# EAGLE design perfboard-tiny45usb1 (EAGLE 5.06)
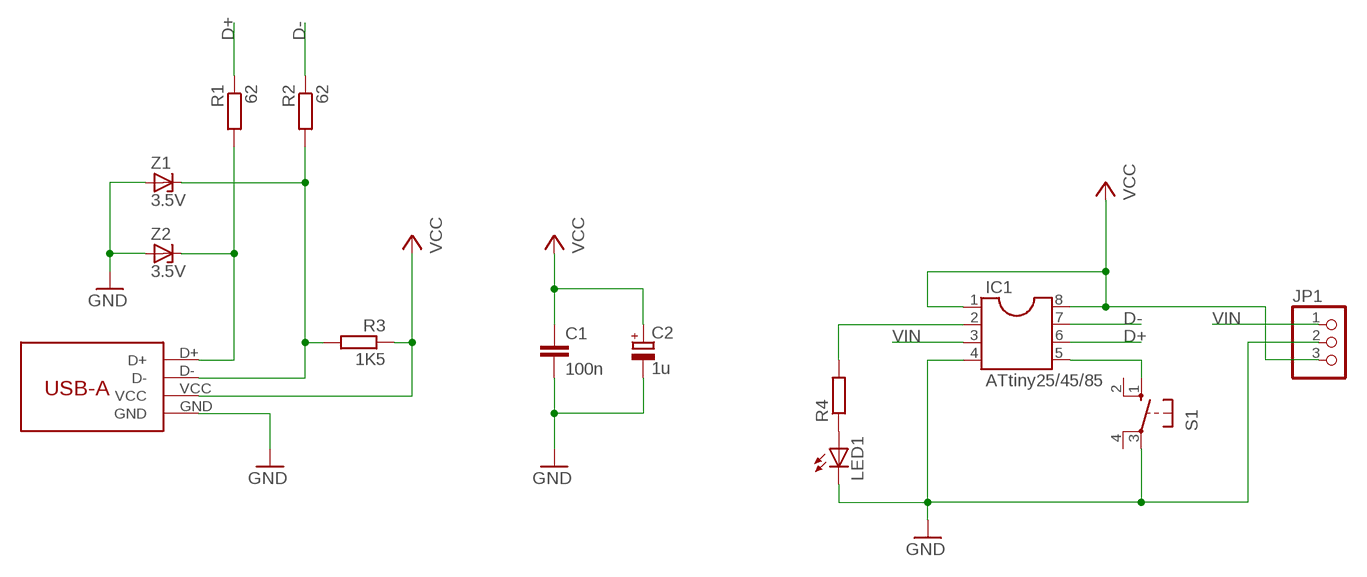
[diagram p0: schematic, sheet 1]

## Parts
C1  100n  CYYC10B4  [YC10B4]
C2  1u  CPOL-EUE2,5-6E  [E2,5-6E]
IC1  ATtiny25/45/85  DIL8  [DIL08]
JP1  PINHD-1X3  [1X03]
LED1  LED3MM  [LED3MM]
R1  62  R-EU_0204/2V  [0204V]
R2  62  R-EU_0204/2V  [0204V]
R3  1K5  R-EU_0207/2V  [0207/2V]
R4  R-EU_0204/7  [0204/7]
S1  10-XX  [B3F-10XX]
U$2  USB-A  [DIP]
Z1  3.5V  ZENER-DIODEZD-7.5  [ZDIO-7.5]
Z2  3.5V  ZENER-DIODEZD-5  [ZDIO-5]

## Nets
D+: IC1.6 R1.1
D-: IC1.7 R2.1
GND: C1.2 C2.- IC1.4 JP1.2 LED1.K(C) S1.3(P) U$2.GND Z1.A Z2.A
N$1: R1.2 U$2.D+ Z2.C
N$2: R2.2 R3.2 U$2.D- Z1.C
N$3: IC1.5 S1.1(S)
N$6: LED1.A R4.1
N$7: IC1.2 R4.2
VCC: C1.1 C2.+ IC1.1 IC1.8 JP1.3 R3.1 U$2.VCC
VIN: IC1.3 JP1.1
Unconnected: S1.2(S1) S1.4(P1)

## Library data of the parts
C1 = rcl:CY: Y CAPACITOR for power line
C2 = rcl:CPOL-EU: POLARIZED CAPACITOR, European symbol
IC1 = ic-package:DIL8: Dual In Line / Socket
JP1 = pinhead:PINHD-1X3: PIN HEADER
LED1 = led:LED: LED OSRAM: - CHIPLED LG R971, LG N971, LY N971, LG Q971, LY Q971, LO R971, LY R971 LH N974, LH R974 LS Q976, LO Q976, LY Q976 LO Q996 - Hyper CHIPLED LW Q18S LB Q993, LB Q99A, LB R99A - SideLED LS A670, LO A670, LY A670, LG A670, LP A670 LB A673, LV A673, LT A673, LW A673 LH A674 LY A675 LS A676, LA A676, LO A676, LY A676, LW A676 LS A679, LY A679, LG A679 - Hyper Micro SIDELED® LS Y876, LA Y876, LO Y876, LY Y876 LT Y87S - SmartLED LW L88C, LW L88S LB L89C, LB L89S, LG L890 LS L89K, LO L89K, LY L89K LS L896, LA L896, LO L896, LY L896 - TOPLED LS T670, LO T670, LY T670, LG T670, LP T670 LSG T670, LSP T670, LSY T670, LOP T670, LYG T670 LG T671, LOG T671, LSG T671 LB T673, LV T673, LT T673, LW T673 LH T674 LS T676, LA T676, LO T676, LY T676, LB T676, LH T676, LSB T676, LW T676 LB T67C, LV T67C, LT T67C, LS T67K, LO T67K, LY T67K, LW E67C LS E67B, LA E67B, LO E67B, LY E67B, LB E67C, LV E67C, LT E67C LW T67C LS T679, LY T679, LG T679 LS T770, LO T770, LY T770, LG T770, LP T770 LB T773, LV T773, LT T773, LW T773 LH T774 LS E675, LA E675, LY E675, LS T675 LS T776, LA T776, LO T776, LY T776, LB T776 LHGB T686 LT T68C, LB T68C - Hyper Mini TOPLED® LB M676 - Mini TOPLED Santana® LG M470 LS M47K, LO M47K, LY M47K Source: http://www.osram.convergy.de LUXEON: - LUMILED® LXK2-PW12-R00, LXK2-PW12-S00, LXK2-PW14-U00, LXK2-PW14-V00 LXK2-PM12-R00, LXK2-PM12-S00, LXK2-PM14-U00 LXK2-PE12-Q00, LXK2-PE12-R00, LXK2-PE12-S00, LXK2-PE14-T00, LXK2-PE14-U00 LXK2-PB12-K00, LXK2-PB12-L00, LXK2-PB12-M00, LXK2-PB14-N00, LXK2-PB14-P00, LXK2-PB14-Q00 LXK2-PR12-L00, LXK2-PR12-M00, LXK2-PR14-Q00, LXK2-PR14-R00 LXK2-PD12-Q00, LXK2-PD12-R00, LXK2-PD12-S00 LXK2-PH12-R00, LXK2-PH12-S00 LXK2-PL12-P00, LXK2-PL12-Q00, LXK2-PL12-R00 Source: www.luxeon.com KINGBRIGHT: KA-3528ASYC Source: www.kingbright.com
R1-R4 = rcl:R-EU_: RESISTOR, European symbol
S1 = switch-omron:10-XX: OMRON SWITCH
U$2 = assmann-usb-a-dip:USB-A
Z1 Z2 = diode:ZENER-DIODE: Z-Diode

## Board
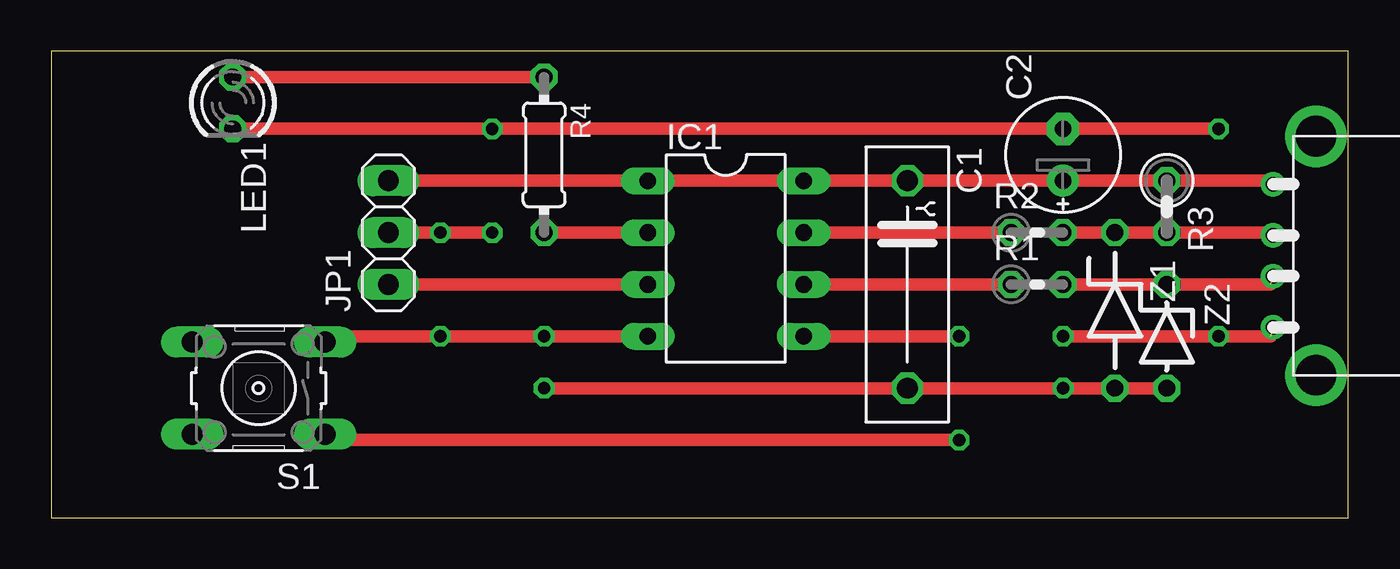
[diagram p1: board, top side]
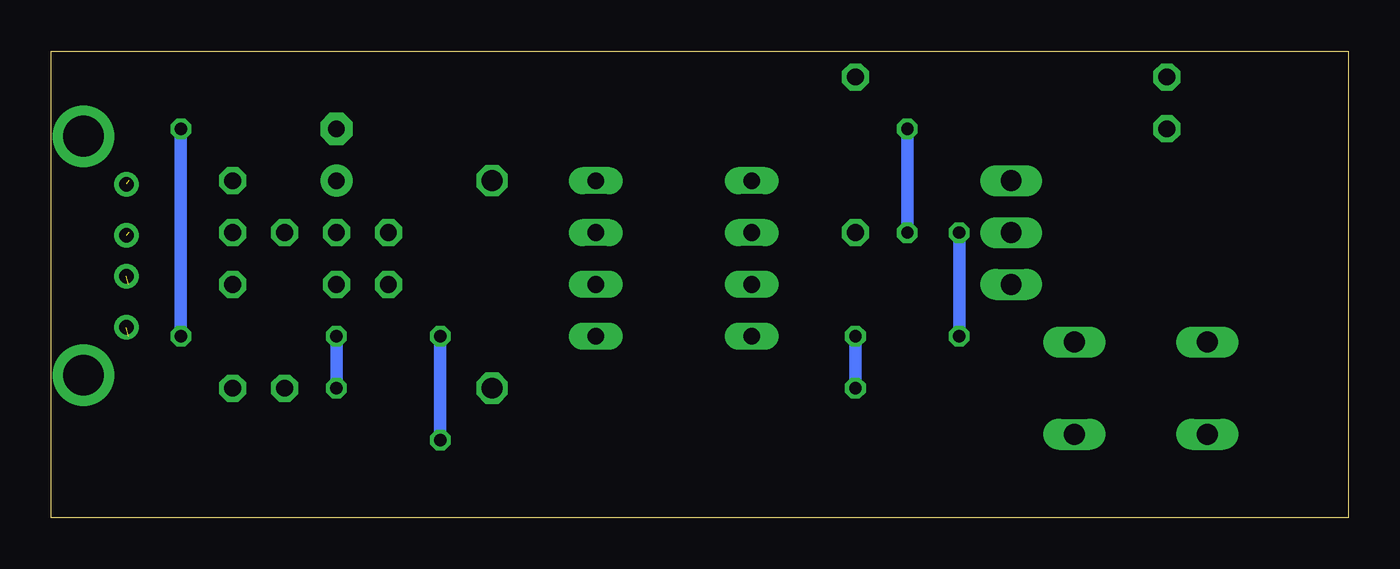
[diagram p2: board, bottom side, seen from below]

Size 63.5 x 22.86 mm. Coordinates in mm from the lower left corner, seen from the top.
Outline: 0,0 63.5,0 63.5,22.86 0,22.86 0,0
Copper layers (1*16): Top 0.035mm / dielectric 1.5mm / Bottom 0.035mm
Design rules "default": minimum track width 10mil, minimum drill 24mil, track to track 8mil, track to pad 8mil, pad to pad 8mil, via to via 8mil, smd to smd 8mil, copper to edge 40mil, drill to drill 8mil, minimum pad ring 10mil, minimum via ring 8mil, stop-mask expansion 4mil, vias tented up to drill 0mil, thermal gap 10mil

### Footprints (pad centres in the part's own frame; a part is rotated, then mirrored left to right if it is on the bottom)
YC10B4 = drill 1.016 octagon: 1 -5.08,0; 2 5.08,0
E2,5-6E = drill 0.813 pad 1.575 round: + -1.27,0 | drill 0.813 pad 1.575 octagon: - 1.27,0
DIL08 = drill 0.813 long: 1 -3.81,-3.81; 2 -1.27,-3.81; 3 1.27,-3.81; 4 3.81,-3.81; 5 3.81,3.81; 6 1.27,3.81; 7 -1.27,3.81; 8 -3.81,3.81
1X03 = drill 1.016 long: 1 -2.54,0; 2 0,0; 3 2.54,0
LED3MM = drill 0.813 octagon: A -1.27,0; K 1.27,0
0204V = drill 0.813 octagon: 1 -1.27,0; 2 1.27,0
0207/2V = drill 0.813 octagon: 1 -1.27,0; 2 1.27,0
0204/7 = drill 0.813 octagon: 1 -3.81,0; 2 3.81,0
B3F-10XX = drill 1.016 long: 1 -3.251,2.261; 2 3.251,2.261; 3 -3.251,-2.261; 4 3.251,-2.261
DIP = drill 0.7 round: D+ 4.85,2.1; D- 6.85,2.1; GND 2.35,2.1; VCC 9.35,2.1 | drill 2 round: P$1 0,0; P$2 11.7,0
ZDIO-7.5 = drill 0.813 octagon: A 3.81,0; C -3.81,0
ZDIO-5 = drill 0.813 octagon: A 2.54,0; C -2.54,0

### Placement (x,y rotation side)
C1  41.91,11.43 270 top
C2  49.53,17.78 90 top
IC1  33.02,12.7 270 top
JP1  16.51,13.97 90 top
LED1  8.89,20.32 270 top
R1  48.26,11.43 0 top
R2  48.26,13.97 0 top
R3  54.61,15.24 270 top
R4  24.13,17.78 270 top
S1  10.16,6.35 180 top
U$2  61.91,6.98 90 top
Z1  52.07,10.16 270 top
Z2  54.61,8.89 270 top

### Tracks (layer width: path | path; a pad name or v marks a point on that pad's centre or on a via)
D+
  Top 0.61: IC1.6 R1.1
D-
  Top 0.61: IC1.7 R2.1
GND  (via drill 0.6)  (1 unrouted)
  Top 0.61: v57.15,19.05 C2.- v21.59,19.05 LED1.K | v49.53,8.89 v57.15,8.89 59.69,8.89 | v24.13,6.35 C1.2 v49.53,6.35 Z1.A Z2.A | IC1.4 v24.13,8.89 v19.05,8.89 13.69,8.89 S1.3 | JP1.2 v19.05,13.97 v21.59,13.97
  Bottom 0.61: v57.15,19.05 v57.15,8.89 | v49.53,6.35 v49.53,8.89 | v24.13,8.89 v24.13,6.35 | v21.59,13.97 v21.59,19.05 | v19.05,8.89 v19.05,13.97
N$1  (1 unrouted)
  Top 0.61: R1.2 Z2.C 59.69,11.43
N$2  (1 unrouted)
  Top 0.61: R2.2 Z1.C R3.2 59.69,13.97
N$3  (via drill 0.6)
  Top 0.61: IC1.5 v44.45,8.89 | v44.45,3.81 13.41,3.81 S1.1
  Bottom 0.61: v44.45,8.89 v44.45,3.81
N$6
  Top 0.61: LED1.A R4.1
N$7
  Top 0.61: R4.2 IC1.2
VCC  (1 unrouted)
  Top 0.61: JP1.3 IC1.1 IC1.8 C1.1 C2.+ R3.1 59.69,16.51
VIN
  Top 0.61: JP1.1 IC1.3

### Text on the board
Document: +5V | 1 | GND | V1